# Altium schematic sheet Power.SchDoc
size A3
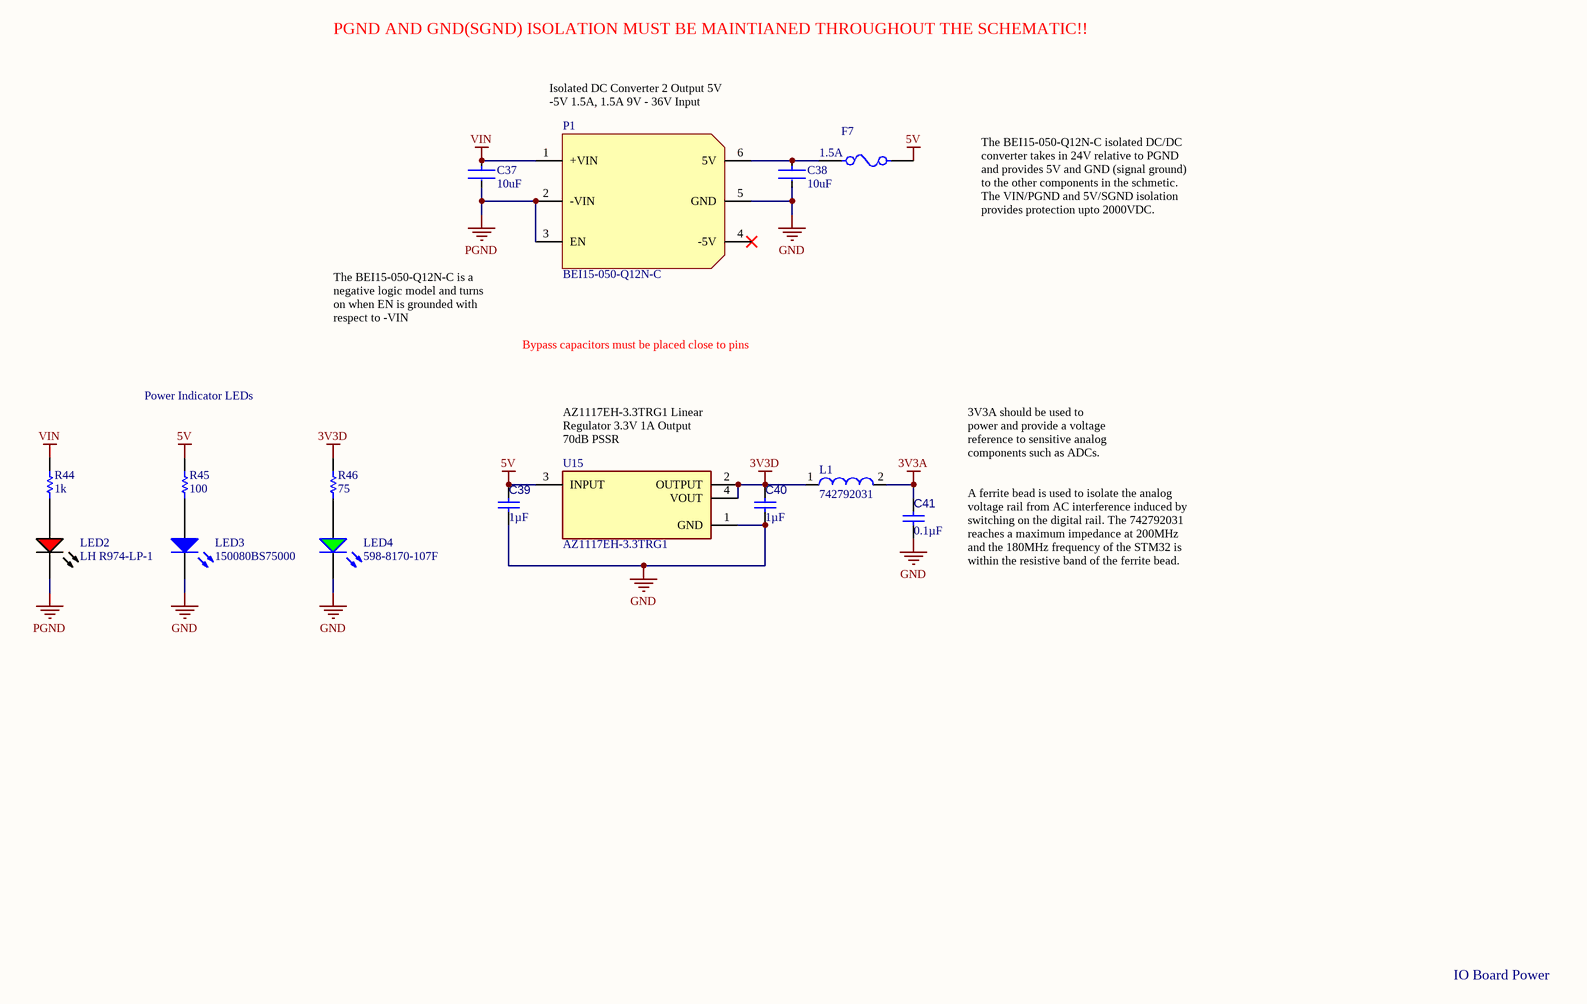
[diagram p0: Power.SchDoc]

## Parts
C37  10uF  [FP-CL32-IPC_C]
C38  10uF  [FP-CL32-IPC_C]
C39  1µF  [CAPC2013X145X50ML20T25]
C40  1µF  [CAPC2013X145X50ML20T25]
C41  0.1µF  [CAPC2013X145X50ML20T25]
F7  1.5A  [FUSC1608X43N]
L1  742792031  [SMD-0805]
LED2  LH R974-LP-1  [0805_A]
LED3  150080BS75000  [0805_A]
LED4  598-8170-107F  [0805_A]
P1  BEI15-050-Q12N-C  [BEI15-050-Q12N-C]
R44  1k  [RESC2013X50X35ML15T15]
R45  100  [RESC2013X50X35ML15T15]
R46  75  [RESC2013X50X35ML15T15]
U15  AZ1117EH-3.3TRG1  [FP-SOT223-MFG]

## Nets
3V3A: C41.1 L1.2
3V3D: C40.2 L1.1 R46.1 U15.2(OUTPUT) U15.4(VOUT)
5V: C39.2 F7.2 R45.2 U15.3(INPUT)
GND: C38.2 C39.1 C40.1 C41.2 LED3.1(K) LED4.1(K) P1.5(GND) U15.1(GND)
PGND: C37.2 LED2.1(K) P1.2(-VIN) P1.3(EN)
VIN: C37.1 P1.1(+VIN) R44.1
NetC38_1: C38.1 F7.1 P1.6(5V)
NetLED2_2: LED2.2(A) R44.2
NetLED3_2: LED3.2(A) R45.1
NetLED4_2: LED4.2(A) R46.2

Not connected (* = marked no-connect by the designer): P1 4(-5V)*

## Notes on the sheet
- PGND AND GND(SGND) ISOLATION MUST BE MAINTIANED THROUGHOUT THE SCHEMATIC!!
- Isolated DC Converter 2 Output 5V -5V 1.5A, 1.5A 9V - 36V Input
- The BEI15-050-Q12N-C isolated DC/DC converter takes in 24V relative to PGND and provides 5V and GND (signal ground) to the other components in the schmetic. The VIN/PGND and 5V/SGND isolation provides protection upto 2000VDC.
- The BEI15-050-Q12N-C is a negative logic model and turns on when EN is grounded with respect to -VIN
- Bypass capacitors must be placed close to pins
- Power Indicator LEDs
- (near U15) AZ1117EH-3.3TRG1 Linear Regulator 3.3V 1A Output 70dB PSSR
- 3V3A should be used to power and provide a voltage reference to sensitive analog components such as ADCs.
- A ferrite bead is used to isolate the analog voltage rail from AC interference induced by switching on the digital rail. The 742792031 reaches a maximum impedance at 200MHz and the 180MHz frequency of the STM32 is within the resistive band of the ferrite bead.
- IO Board Power

## Library data of the parts
C37 C38 = CMP-13271-000075-1: Cap Ceramic 10uF 35V Y5V -20/+80% SMD 1210 +85°C Embossed T/R; Manufacturer: Murata; Manufacturer Part Number: GRM32ER71H106KA12L; Tolerance: 10%; Voltage Rating: 50V; Dielectric: X7R; Value: 10uF; Supplier 1: Digi-Key; Supplier Part Number 1: 490-6544-1-ND; RoHS: Yes; Category: Ceramic Capacitors; Stock 1: 152438; Pricing 1: 1=1.31000, 10=1.03400, 50=0.89600, 100=0.77540, 500=0.58584 (USD); Mount: Surface Mount; Case/Package: 1210; Case Code (Imperial): 1210; Case Code (Metric): 3225; Material: Ceramic; Min Operating Temperature: -55°C; Max Operating Temperature: 125°C; Capacitance: 10uF; Package Quantity: 1000; Packaging: Tape and Reel; Voltage Rating (DC): 50V; Termination: SMD/SMT; Voltage: 50V; Length: 3.2mm; Height: 2.5mm; Width: 2.5mm; Thickness: 0.106inch; Depth: 2.5mm; Radiation Hardening: No; REACH SVHC: No SVHC; Lead Free: Lead Free; ComponentLink1URL: https://datasheet.ciiva.com/16497/product-16497010.pdf?src-supplier=Future+Electronics; ComponentLink1Description: https://datasheet.ciiva.com/16497/product-16497010.pdf?src-supplier=Future+Electronics; ComponentLink2URL: https://datasheet.ciiva.com/11789/0900766b80ef921d-11789081.pdf?src-supplier=RSComponents; ComponentLink2Description: https://datasheet.ciiva.com/11789/0900766b80ef921d-11789081.pdf?src-supplier=RSComponents; ComponentLink3URL: https://datasheet.ciiva.com/3777/4286grm32er71h106ka1223-3777306.pdf?src-supplier=Arrow+Electronics; ComponentLink3Description: https://datasheet.ciiva.com/3777/4286grm32er71h106ka1223-3777306.pdf?src-supplier=Arrow+Electronics; ComponentLink4URL: https://datasheet.ciiva.com/6270/partnumbering-e-01-6270167.pdf?src-supplier=Digi-Key; ComponentLink4Description: https://datasheet.ciiva.com/6270/partnumbering-e-01-6270167.pdf?src-supplier=Digi-Key; ComponentLink5URL: https://datasheet.ciiva.com/6270/partnumbering-e-01-6270168.pdf?src-supplier=Digi-Key; ComponentLink5Description: https://datasheet.ciiva.com/6270/partnumbering-e-01-6270168.pdf?src-supplier=Digi-Key; ComponentLink6URL: https://datasheet.ciiva.com/6270/partnumbering-e-01-6270169.pdf?src-supplier=Digi-Key; ComponentLink6Description: https://datasheet.ciiva.com/6270/partnumbering-e-01-6270169.pdf?src-supplier=Digi-Key; ComponentLink7URL: https://datasheet.ciiva.com/11607/c02e-11607596.pdf?src-supplier=Avnet; ComponentLink7Description: https://datasheet.ciiva.com/11607/c02e-11607596.pdf?src-supplier=Avnet; ComponentLink8URL: https://datasheet.ciiva.com/46441/1754714-46441340.pdf?src-supplier=Element14; ComponentLink8Description: https://datasheet.ciiva.com/46441/1754714-46441340.pdf?src-supplier=Element14
C39 C40 = CMP-001-00010-4: Chip Capacitor, 1 uF, +/-10%, 25 V, 0805 (2012 Metric); Manufacturer: KEMET; Manufacturer Part Number: C0805C105K3RACTU; Dielectric Material: Ceramic; Capacitance: 1uF; Tolerance: 10%; Dielectric: X7R; Voltage: 25V; Value: 1µF; Supplier 1: Digi-Key; Supplier Part Number 1: 399-8004-1-ND; RoHS: Yes; Category: Ceramic Capacitors; Stock 1: 360844; Pricing 1: 1=0.14000, 10=0.10100, 50=0.05720, 100=0.04740, 500=0.03322, 1000=0.02750 (USD); Mount: Surface Mount; Case/Package: 0805; Number of Pins: 2; Contact Plating: Tin,Matte; Case Code (Imperial): 0805; Case Code (Metric): 2012; Min Operating Temperature: -55°C; Max Operating Temperature: 125°C; Packaging: Tape and Reel; Termination: SMD/SMT; Package Quantity: 1; Voltage Rating: 25V; Voltage Rating (DC): 25V; Length: 2mm; Height: 1.25mm; Depth: 1.25mm; Width: 0.049inch; Thickness: 0.055inch; Radiation Hardening: No; REACH SVHC: No SVHC; ComponentLink1URL: https://datasheet.ciiva.com/6074/kem-c1002-x7r-smd-6074661.pdf?src-supplier=Farnell; ComponentLink1Description: https://datasheet.ciiva.com/6074/kem-c1002-x7r-smd-6074661.pdf?src-supplier=Farnell; ComponentLink2URL: https://datasheet.ciiva.com/28610/1918693-28610874.pdf?src-supplier=Element14; ComponentLink2Description: https://datasheet.ciiva.com/28610/1918693-28610874.pdf?src-supplier=Element14
C41 = CMP-001-00010-4: Chip Capacitor, 0.1 uF, +/-10%, 25 V, 0805 (2012 Metric); Manufacturer: KEMET; Manufacturer Part Number: C0805C104K3RACTU; Dielectric Material: Ceramic; Tolerance: 10%; Capacitance: 100nF; Dielectric: X7R; Voltage: 25V; Value: 0.1µF; Supplier 1: Digi-Key; Supplier Part Number 1: 399-1168-1-ND; RoHS: Yes; Category: Ceramic Capacitors; Stock 1: 417116; Pricing 1: 1=0.14000, 10=0.10000, 50=0.05660, 100=0.04680, 500=0.03284, 1000=0.02719 (USD); Mount: Surface Mount; Case/Package: 0805; Min Operating Temperature: -55°C; Max Operating Temperature: 125°C; Packaging: Tape and Reel; Termination: SMD/SMT; Length: 2mm; Height: 0.9mm; Depth: 1.25mm; Radiation Hardening: No; ComponentLink1URL: https://datasheet.ciiva.com/18193/getdatasheetpartid-385649-18193413.pdf?src-supplier=Verical; ComponentLink1Description: https://datasheet.ciiva.com/18193/getdatasheetpartid-385649-18193413.pdf?src-supplier=Verical; ComponentLink2URL: https://datasheet.ciiva.com/7842/kem-c1002-x7r-smd-7842536.pdf?src-supplier=Element14; ComponentLink2Description: https://datasheet.ciiva.com/7842/kem-c1002-x7r-smd-7842536.pdf?src-supplier=Element14; ComponentLink3URL: https://datasheet.ciiva.com/7842/kem-c1002-x7r-smd-7842538.pdf?src-supplier=Element14; ComponentLink3Description: https://datasheet.ciiva.com/7842/kem-c1002-x7r-smd-7842538.pdf?src-supplier=Element14
F7 = 046701.5NR: 1.5A 0603 Fuse; Manufacturer_Name: LITTELFUSE; Datasheet Link: https://www.littelfuse.com/~/media/electronics/datasheets/fuses/littelfuse_fuse_467_datasheet.pdf.pdf; Height: 0.432mm; Manufacturer_Part_Number: 046701.5NR; Arrow Part Number: 046701.5NR; Arrow Price/Stock: https://www.arrow.com/en/products/046701.5nr/littelfuse; Mouser Part Number: 576-046701.5NR; Mouser Price/Stock: https://www.mouser.com/Search/Refine.aspx?Keyword=576-046701.5NR; Value: 1.5A
L1 = CMP-0220-00025-1: SMD EMI Suppression Ferrite Bead WE-CBF, Z = 300 Ohm; Impedance: 300 Ohm; ComponentLink1URL: http://www.we-online.com; PackageVersion: 2005; ComponentLink1Description: Manufacturer Link; ComponentLink2Description: Datasheet; DatasheetVersion: Dec-2005; ComponentLink2URL: http://www.we-online.de/katalog/media/pdf/742792031.pdf; PackageReference: SMD-0805; PackageDescription: Chip Inductor, 2-Leads, Body 2.0 x 1.2 mm
LED2 = CMP-62016-000032-1: LED RED DIFFUSED 0805 SMD; Number of Elements: 1; Forward Voltage: 2.6V; Viewing Angle: 160°; Reverse Voltage: 5V; Test Current: 20mA; Dominant Wavelength: 645nm; Forward Current: 30mA; Luminous Intensity: 15mcd; Depth: 1.35mm; Min Operating Temperature: -30°C; Length: 2.1mm; Max Operating Temperature: 85°C; Radiation Hardening: No; Packaging: Tape and Reel; Number of Pins: 2; Mount: Surface Mount; Lens Style: Diffused
LED3 = CMP-1426-00008-1: SMD mono-color Chip LED, WL-SMCW, Blue; Manufacturer: Wuerth Elektronik; Color: Blue; ComponentLink2URL: http://katalog.we-online.com/led/datasheet/150080BS75000.pdf; ComponentLink1URL: http://www.we-online.com; ComponentLink2Description: Datasheet; PackageReference: 0805_A; ComponentLink1Description: Manufacturer URL; PartNumber: 150080BS75000
LED4 = CMP-2000-05655-1: Single Color, 2 V, -30 to 85 degC, 2-Pin SMD (0805), RoHS, Tape and Reel; Manufacturer: Dialight; Main Category: ChipLED; Shape Type: Rectangular; Forward Current: 25mA; Product Length (mm): 2mm; Emitting Color: YellowGreen; Test Current (It): 20mA; Number of  Elements: 1; Luminous Intensity: 20mcd; DELETED: Compliant; Reverse Voltage: 5V; Chip Material: GaP; High Brightness: No; Viewing Angle: 140deg; Dominant Wave Length: 570nm; Type: Uni-Color; Product Depth (mm): 1.25mm; Power Dissipation: 60W; Product Height (mm): 0.7mm; Forward Voltage: 2.4V; Lens Dimensions: 1.4x1.25x0.4mm; Pin Count: 2; Datasheet URL: https://datasheet.ciiva.com/22748/1484480-22748121.pdf; Operating Temperature Classification: Commercial; Package Reference: 0805; Operating Temp Range: -30Cto85C; Mounting: SurfaceMount; Mounting Technology: SurfaceMount; Manufacturer URL: http://www.dialight.com/; Package Description: 2-Pin Surface Mount Device, Body 2 x 1.25 mm; Lum Intensity: 20mcd; Datasheet Version: 10/2008; Rad Hardened: No; Packaging: TapeandReel; Package Type: SMD
P1 = BEI15-050-Q12N-C: DC Converter 2 Output 5V -5V 1.5A, 1.5A 9V - 36V Input; Manufacturer: Murata; Datasheet: https://www.murata.com/products/productdata/8807024656414/bei15.pdf?1583754810000; Model: BEI15-050-Q12N-C; Digi-Key Part Number: 811-2180-5-ND
R44 = CMP-009-00001-4: Chip Resistor, 1k Ohm, +/- 1%, 125 mW, -55 to 155 degC, 0805 (2012 Metric); Manufacturer: Panasonic; Manufacturer Part Number: ERA-6AEB102V; Resistance: 1kR; Tolerance: 0.1%; Temperature Coefficient: 25ppm/°C; Voltage Rating: 100V; Power Rating: 125mW; Value: 1k; Supplier 1: Digi-Key; Supplier Part Number 1: P1.0KDACT-ND; RoHS: Yes; Category: Chip SMD Resistors; Stock 1: 122815; Pricing 1: 1=0.33000, 10=0.27800, 100=0.10850, 1000=0.04541, 2500=0.04163 (USD); Mount: Surface Mount; Case/Package: 0805; Number of Pins: 2; Contact Plating: Tin; Case Code (Metric): 2012; Case Code (Imperial): 0805; Min Operating Temperature: -55°C; Max Operating Temperature: 155°C; Composition: Thin Film; Packaging: Tape and Reel; Package Quantity: 5000; Number of Terminations: 2; Military Standard: Not; Termination: SMD/SMT; Max Power Dissipation: 125mW; Working Voltage: 100V; Length: 2mm; Height: 0.5mm; Width: 1.25mm; Depth: 1.25mm; Radiation Hardening: No; REACH SVHC: No SVHC; ComponentLink1URL: https://datasheet.ciiva.com/11811/0900766b80beefcc-11811155.pdf?src-supplier=RSComponents; ComponentLink1Description: https://datasheet.ciiva.com/11811/0900766b80beefcc-11811155.pdf?src-supplier=RSComponents; ComponentLink2URL: https://datasheet.ciiva.com/29184/453027-da-01-en-widerstand-0805-era-29184108.pdf?src-supplier=Conrad; ComponentLink2Description: https://datasheet.ciiva.com/29184/453027-da-01-en-widerstand-0805-era-29184108.pdf?src-supplier=Conrad; ComponentLink3URL: https://datasheet.ciiva.com/30057/54aoa0000ce26-30057591.pdf?src-supplier=Onlinecomponents.com; ComponentLink3Description: https://datasheet.ciiva.com/30057/54aoa0000ce26-30057591.pdf?src-supplier=Onlinecomponents.com; ComponentLink4URL: https://datasheet.ciiva.com/48536/era-eng-tds-48536727.pdf?src-supplier=Distrelec; ComponentLink4Description: https://datasheet.ciiva.com/48536/era-eng-tds-48536727.pdf?src-supplier=Distrelec; ComponentLink5URL: https://datasheet.ciiva.com/9198/aoa0000ce26-9198984.pdf?src-supplier=Avnet; ComponentLink5Description: https://datasheet.ciiva.com/9198/aoa0000ce26-9198984.pdf?src-supplier=Avnet; ComponentLink6URL: https://datasheet.ciiva.com/16782/70068849-16782808.pdf?src-supplier=Allied+Electronics; ComponentLink6Description: https://datasheet.ciiva.com/16782/70068849-16782808.pdf?src-supplier=Allied+Electronics; ComponentLink7URL: https://datasheet.ciiva.com/24025/aoa0000ce26-197354-24025849.pdf?src-supplier=Mouser; ComponentLink7Description: https://datasheet.ciiva.com/24025/aoa0000ce26-197354-24025849.pdf?src-supplier=Mouser; ComponentLink8URL: https://datasheet.ciiva.com/43455/485442-43455257.pdf?src-supplier=Farnell; ComponentLink8Description: https://datasheet.ciiva.com/43455/485442-43455257.pdf?src-supplier=Farnell; ComponentLink9URL: https://datasheet.ciiva.com/43457/485442-43457803.pdf?src-supplier=Farnell; ComponentLink9Description: https://datasheet.ciiva.com/43457/485442-43457803.pdf?src-supplier=Farnell; ComponentLink10URL: https://datasheet.ciiva.com/7942/485442-7942414.pdf?src-supplier=Element14; ComponentLink10Description: https://datasheet.ciiva.com/7942/485442-7942414.pdf?src-supplier=Element14; ComponentLink11URL: https://datasheet.ciiva.com/16201/aoa0000ce26-16201486.pdf?src-supplier=Future+Electronics; ComponentLink11Description: https://datasheet.ciiva.com/16201/aoa0000ce26-16201486.pdf?src-supplier=Future+Electronics; ComponentLink12URL: https://datasheet.ciiva.com/22783/485442-22783806.pdf?src-supplier=Farnell; ComponentLink12Description: https://datasheet.ciiva.com/22783/485442-22783806.pdf?src-supplier=Farnell; ComponentLink13URL: https://datasheet.ciiva.com/7942/485442-7942415.pdf?src-supplier=Element14; ComponentLink13Description: https://datasheet.ciiva.com/7942/485442-7942415.pdf?src-supplier=Element14
R45 = CMP-009-00001-4: Chip Resistor, 100 Ohm, +/- 1%, 125 mW, -55 to 155 degC, 0805 (2012 Metric); Manufacturer: Panasonic; Manufacturer Part Number: ERA-6AEB101V; Tolerance: 0.1%; Resistance: 100R; Temperature Coefficient: 25ppm/°C; Power Rating: 125mW; Voltage Rating: 100V; Value: 100; Supplier 1: Digi-Key; Supplier Part Number 1: P100DACT-ND; RoHS: Yes; Category: Chip SMD Resistors; Stock 1: 127229; Pricing 1: 1=0.33000, 10=0.27800, 100=0.10850, 1000=0.04541, 2500=0.04163 (USD); Mount: Surface Mount; Case/Package: 0805; Number of Pins: 2; Contact Plating: Tin; Case Code (Imperial): 0805; Case Code (Metric): 2012; Min Operating Temperature: -55°C; Max Operating Temperature: 155°C; Composition: Metal Film,Thin Film; Packaging: Tape and Reel; Package Quantity: 1; Termination: SMD/SMT; Number of Terminations: 2; Military Standard: Not; Max Power Dissipation: 125mW; Voltage Rating (DC): 100V; Features: Automotive AEC-Q200; Length: 2mm; Height: 0.5mm; Width: 1.25mm; Depth: 1.25mm; Radiation Hardening: No; REACH SVHC: No SVHC; Lead Free: Lead Free; ComponentLink1URL: https://datasheet.ciiva.com/11810/0900766b80beefcc-11810733.pdf?src-supplier=RSComponents; ComponentLink1Description: https://datasheet.ciiva.com/11810/0900766b80beefcc-11810733.pdf?src-supplier=RSComponents; ComponentLink2URL: https://datasheet.ciiva.com/29184/452698-da-01-en-widerstand-0805-era-29184051.pdf?src-supplier=Conrad; ComponentLink2Description: https://datasheet.ciiva.com/29184/452698-da-01-en-widerstand-0805-era-29184051.pdf?src-supplier=Conrad; ComponentLink3URL: https://datasheet.ciiva.com/16774/70068849-16774677.pdf?src-supplier=Allied+Electronics; ComponentLink3Description: https://datasheet.ciiva.com/16774/70068849-16774677.pdf?src-supplier=Allied+Electronics; ComponentLink4URL: https://datasheet.ciiva.com/22758/485442-22758149.pdf?src-supplier=Farnell; ComponentLink4Description: https://datasheet.ciiva.com/22758/485442-22758149.pdf?src-supplier=Farnell; ComponentLink5URL: https://datasheet.ciiva.com/46438/485442-46438213.pdf?src-supplier=Element14; ComponentLink5Description: https://datasheet.ciiva.com/46438/485442-46438213.pdf?src-supplier=Element14; ComponentLink6URL: https://datasheet.ciiva.com/16770/70068849-16770007.pdf?src-supplier=Allied+Electronics; ComponentLink6Description: https://datasheet.ciiva.com/16770/70068849-16770007.pdf?src-supplier=Allied+Electronics; ComponentLink7URL: https://datasheet.ciiva.com/46438/485442-46438214.pdf?src-supplier=Element14; ComponentLink7Description: https://datasheet.ciiva.com/46438/485442-46438214.pdf?src-supplier=Element14; ComponentLink8URL: https://datasheet.ciiva.com/30140/54aoa0000ce26-30140696.pdf?src-supplier=Onlinecomponents.com; ComponentLink8Description: https://datasheet.ciiva.com/30140/54aoa0000ce26-30140696.pdf?src-supplier=Onlinecomponents.com; ComponentLink9URL: https://datasheet.ciiva.com/17207/aoa0000ce26-17207961.pdf?src-supplier=Avnet+Europe; ComponentLink9Description: https://datasheet.ciiva.com/17207/aoa0000ce26-17207961.pdf?src-supplier=Avnet+Europe; ComponentLink10URL: https://datasheet.ciiva.com/24072/aoa0000ce26-32660-24072217.pdf?src-supplier=Mouser; ComponentLink10Description: https://datasheet.ciiva.com/24072/aoa0000ce26-32660-24072217.pdf?src-supplier=Mouser; ComponentLink11URL: https://datasheet.ciiva.com/28513/485442-28513850.pdf?src-supplier=Element14; ComponentLink11Description: https://datasheet.ciiva.com/28513/485442-28513850.pdf?src-supplier=Element14; ComponentLink12URL: https://datasheet.ciiva.com/48536/era-eng-tds-48536747.pdf?src-supplier=Distrelec; ComponentLink12Description: https://datasheet.ciiva.com/48536/era-eng-tds-48536747.pdf?src-supplier=Distrelec; ComponentLink13URL: https://datasheet.ciiva.com/16396/aoa0000ce26-16396828.pdf?src-supplier=Future+Electronics; ComponentLink13Description: https://datasheet.ciiva.com/16396/aoa0000ce26-16396828.pdf?src-supplier=Future+Electronics; ComponentLink14URL: https://datasheet.ciiva.com/9186/aoa0000ce26-9186749.pdf?src-supplier=Avnet; ComponentLink14Description: https://datasheet.ciiva.com/9186/aoa0000ce26-9186749.pdf?src-supplier=Avnet
R46 = CMP-009-00001-4: Chip Resistor, 75 Ohm, +/- 1%, 125 mW, -55 to 155 degC, 0805 (2012 Metric); Manufacturer: Panasonic; Manufacturer Part Number: ERA-6AEB750V; Resistance: 75R; Tolerance: 0.1%; Temperature Coefficient: 25ppm/°C; Power Rating: 125mW; Voltage Rating: 100V; Value: 75; Supplier 1: Digi-Key; Supplier Part Number 1: P75DACT-ND; RoHS: Yes; Category: Chip SMD Resistors; Stock 1: 28530; Pricing 1: 1=0.33000, 10=0.27800, 100=0.10850, 1000=0.04541, 2500=0.04163 (USD); Mount: Surface Mount; Case/Package: 0805; Number of Pins: 2; Contact Plating: Tin; Case Code (Metric): 2012; Case Code (Imperial): 0805; Min Operating Temperature: -55°C; Max Operating Temperature: 155°C; Composition: Thin Film; Packaging: Tape and Reel; Package Quantity: 5000; Number of Terminations: 2; Termination: SMD/SMT; Military Standard: Not; Max Power Dissipation: 125mW; Voltage Rating (DC): 100V; Length: 2mm; Height: 0.024inch; Width: 0.049inch; Depth: 1.25mm; Radiation Hardening: No; REACH SVHC: Yes; Lead Free: Lead Free; ComponentLink1URL: https://datasheet.ciiva.com/29184/452659-da-01-en-widerstand-0805-era-29184043.pdf?src-supplier=Conrad; ComponentLink1Description: https://datasheet.ciiva.com/29184/452659-da-01-en-widerstand-0805-era-29184043.pdf?src-supplier=Conrad; ComponentLink2URL: https://datasheet.ciiva.com/5917/485442-5917734.pdf?src-supplier=Farnell; ComponentLink2Description: https://datasheet.ciiva.com/5917/485442-5917734.pdf?src-supplier=Farnell; ComponentLink3URL: https://datasheet.ciiva.com/48536/era-eng-tds-48536758.pdf?src-supplier=Distrelec; ComponentLink3Description: https://datasheet.ciiva.com/48536/era-eng-tds-48536758.pdf?src-supplier=Distrelec; ComponentLink4URL: https://datasheet.ciiva.com/5917/485442-5917735.pdf?src-supplier=Farnell; ComponentLink4Description: https://datasheet.ciiva.com/5917/485442-5917735.pdf?src-supplier=Farnell; ComponentLink5URL: https://datasheet.ciiva.com/5917/485442-5917736.pdf?src-supplier=Farnell; ComponentLink5Description: https://datasheet.ciiva.com/5917/485442-5917736.pdf?src-supplier=Farnell; ComponentLink6URL: https://datasheet.ciiva.com/7710/485442-7710664.pdf?src-supplier=Element14; ComponentLink6Description: https://datasheet.ciiva.com/7710/485442-7710664.pdf?src-supplier=Element14; ComponentLink7URL: https://datasheet.ciiva.com/17208/aoa0000ce26-17208633.pdf?src-supplier=Avnet+Europe; ComponentLink7Description: https://datasheet.ciiva.com/17208/aoa0000ce26-17208633.pdf?src-supplier=Avnet+Europe; ComponentLink8URL: https://datasheet.ciiva.com/48425/era-eng-tds-48425627.pdf?src-supplier=Distrelec; ComponentLink8Description: https://datasheet.ciiva.com/48425/era-eng-tds-48425627.pdf?src-supplier=Distrelec; ComponentLink9URL: https://datasheet.ciiva.com/30147/54aoa0000ce26-30147167.pdf?src-supplier=Onlinecomponents.com; ComponentLink9Description: https://datasheet.ciiva.com/30147/54aoa0000ce26-30147167.pdf?src-supplier=Onlinecomponents.com; ComponentLink10URL: https://datasheet.ciiva.com/7710/485442-7710665.pdf?src-supplier=Element14; ComponentLink10Description: https://datasheet.ciiva.com/7710/485442-7710665.pdf?src-supplier=Element14; ComponentLink11URL: https://datasheet.ciiva.com/9187/aoa0000ce26-9187722.pdf?src-supplier=Avnet; ComponentLink11Description: https://datasheet.ciiva.com/9187/aoa0000ce26-9187722.pdf?src-supplier=Avnet
U15 = CMP-12756-000039-1: IC REG LINEAR 3.3V 1A SOT223; Operating Supply Current: 3.5mA; Polarity: Positive; Reference Voltage: 1.262V; Max Input Voltage: 13V; Accuracy: 1%; Power Supply Rejection Ratio (PSRR): 70dB; Number of Regulators: 1; Dropout Voltage: 1.1V; Output Type: Fixed; Output Voltage: 3.3V; Package Quantity: 4000; Lead Free: Lead Free; Number of Pins: 3; Output Current: 1A; Packaging: Tape and Reel; Min Operating Temperature: -40°C; Max Operating Temperature: 125°C; Quiescent Current: 3.5mA; Contact Plating: Tin; Case/Package: TO-261-4; Weight: 0.000282oz; Mount: Surface Mount; Number of Outputs: 1; Max Output Current: 1A